# Altium schematic sheet DIO.SCHDOC
size B
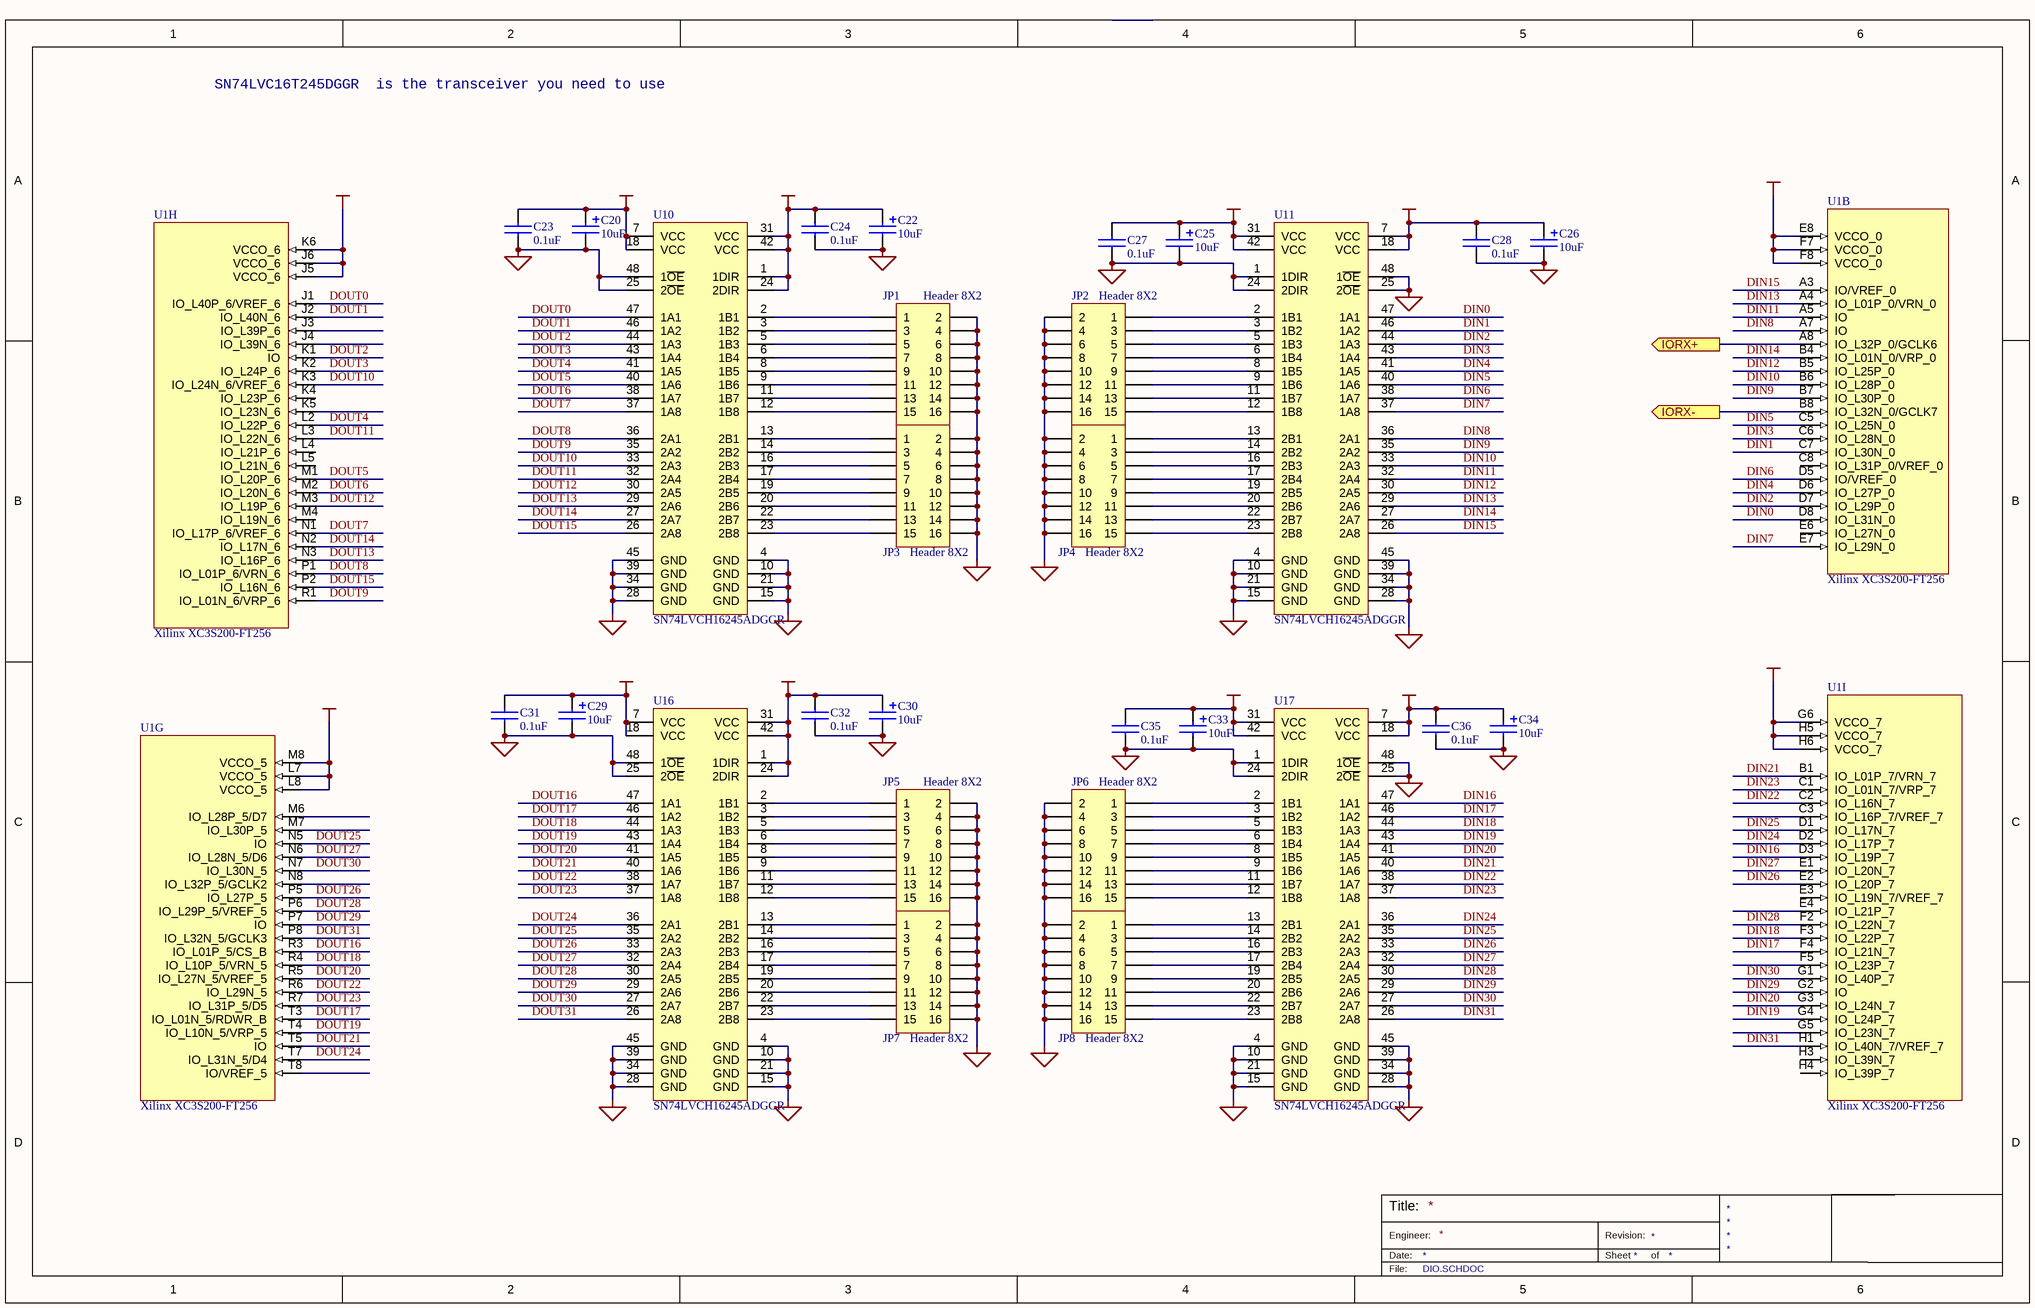
[diagram p0: DIO.SCHDOC]

## Parts
C20  value 10uF  [3216]  (hidden comment: POLCAP)
C22  value 10uF  [3216]  (hidden comment: POLCAP)
C23  value 0.1uF  [0603]  (hidden comment: CAPACITOR)
C24  value 0.1uF  [0603]  (hidden comment: CAPACITOR)
C25  value 10uF  [3216]  (hidden comment: POLCAP)
C26  value 10uF  [3216]  (hidden comment: POLCAP)
C27  value 0.1uF  [0603]  (hidden comment: CAPACITOR)
C28  value 0.1uF  [0603]  (hidden comment: CAPACITOR)
C29  value 10uF  [3216]  (hidden comment: POLCAP)
C30  value 10uF  [3216]  (hidden comment: POLCAP)
C31  value 0.1uF  [0603]  (hidden comment: CAPACITOR)
C32  value 0.1uF  [0603]  (hidden comment: CAPACITOR)
C33  value 10uF  [3216]  (hidden comment: POLCAP)
C34  value 10uF  [3216]  (hidden comment: POLCAP)
C35  value 0.1uF  [0603]  (hidden comment: CAPACITOR)
C36  value 0.1uF  [0603]  (hidden comment: CAPACITOR)
JP1  Header 8X2  [HDR2X8]
JP2  Header 8X2  [HDR2X8]
JP3  Header 8X2  [HDR2X8]
JP4  Header 8X2  [HDR2X8]
JP5  Header 8X2  [HDR2X8]
JP6  Header 8X2  [HDR2X8]
JP7  Header 8X2  [HDR2X8]
JP8  Header 8X2  [HDR2X8]
U1  Xilinx XC3S200-FT256  [Xilinx FT256 BGA]  (parts B,G,H,I of 9)
U10  SN74LVCH16245ADGGR  [TSSO12x8-G48/X.3]
U11  SN74LVCH16245ADGGR  [TSSO12x8-G48/X.3]
U16  SN74LVCH16245ADGGR  [TSSO12x8-G48/X.3]
U17  SN74LVCH16245ADGGR  [TSSO12x8-G48/X.3]

## Ports
IORX+ (out), IORX- (out)

## Nets
+2.5VCC: C22.1 C24.1 C25.1 C27.1 C30.1 C32.1 C33.1 C35.1 U1.E8(VCCO_0) U1.F7(VCCO_0) U1.F8(VCCO_0) U1.G6(VCCO_7) U1.H5(VCCO_7) U1.H6(VCCO_7) U1.J5(VCCO_6) U1.J6(VCCO_6) U1.K6(VCCO_6) U1.L7(VCCO_5) U1.L8(VCCO_5) U1.M8(VCCO_5) U10.1(1DIR) U10.24(2DIR) U10.31(VCC) U10.42(VCC) U11.31(VCC) U11.42(VCC) U16.1(1DIR) U16.24(2DIR) U16.31(VCC) U16.42(VCC) U17.31(VCC) U17.42(VCC)
+5VCC: C20.1 C23.1 C26.1 C28.1 C29.1 C31.1 C34.1 C36.1 U10.7(VCC) U10.18(VCC) U11.7(VCC) U11.18(VCC) U16.7(VCC) U16.18(VCC) U17.7(VCC) U17.18(VCC)
GND: C20.2 C22.2 C23.2 C24.2 C25.2 C26.2 C27.2 C28.2 C29.2 C30.2 C31.2 C32.2 C33.2 C34.2 C35.2 C36.2 JP1.2 JP1.4 JP1.6 JP1.8 JP1.10 JP1.12 JP1.14 JP1.16 JP2.2 JP2.4 JP2.6 JP2.8 JP2.10 JP2.12 JP2.14 JP2.16 JP3.2 JP3.4 JP3.6 JP3.8 JP3.10 JP3.12 JP3.14 JP3.16 JP4.2 JP4.4 JP4.6 JP4.8 JP4.10 JP4.12 JP4.14 JP4.16 JP5.2 JP5.4 JP5.6 JP5.8 JP5.10 JP5.12 JP5.14 JP5.16 JP6.2 JP6.4 JP6.6 JP6.8 JP6.10 JP6.12 JP6.14 JP6.16 JP7.2 JP7.4 JP7.6 JP7.8 JP7.10 JP7.12 JP7.14 JP7.16 JP8.2 JP8.4 JP8.6 JP8.8 JP8.10 JP8.12 JP8.14 JP8.16 U10.4(GND) U10.10(GND) U10.15(GND) U10.21(GND) U10.25(2~{OE}) U10.28(GND) U10.34(GND) U10.39(GND) U10.45(GND) U10.48(1~{OE}) U11.1(1DIR) U11.4(GND) U11.10(GND) U11.15(GND) U11.21(GND) U11.24(2DIR) U11.25(2~{OE}) U11.28(GND) U11.34(GND) U11.39(GND) U11.45(GND) U11.48(1~{OE}) U16.4(GND) U16.10(GND) U16.15(GND) U16.21(GND) U16.25(2~{OE}) U16.28(GND) U16.34(GND) U16.39(GND) U16.45(GND) U16.48(1~{OE}) U17.1(1DIR) U17.4(GND) U17.10(GND) U17.15(GND) U17.21(GND) U17.24(2DIR) U17.25(2~{OE}) U17.28(GND) U17.34(GND) U17.39(GND) U17.45(GND) U17.48(1~{OE})
DIN0: U1.D8(IO_L31N_0) U11.47(1A1)
DIN1: U1.C7(IO_L30N_0) U11.46(1A2)
DIN2: U1.D7(IO_L29P_0) U11.44(1A3)
DIN3: U1.C6(IO_L28N_0) U11.43(1A4)
DIN4: U1.D6(IO_L27P_0) U11.41(1A5)
DIN5: U1.C5(IO_L25N_0) U11.40(1A6)
DIN6: U1.D5(IO/VREF_0) U11.38(1A7)
DIN7: U1.E7(IO_L29N_0) U11.37(1A8)
DIN8: U1.A7(IO) U11.36(2A1)
DIN9: U1.B7(IO_L30P_0) U11.35(2A2)
DIN10: U1.B6(IO_L28P_0) U11.33(2A3)
DIN11: U1.A5(IO) U11.32(2A4)
DIN12: U1.B5(IO_L25P_0) U11.30(2A5)
DIN13: U1.A4(IO_L01P_0/VRN_0) U11.29(2A6)
DIN14: U1.B4(IO_L01N_0/VRP_0) U11.27(2A7)
DIN15: U1.A3(IO/VREF_0) U11.26(2A8)
DIN16: U1.D3(IO_L19P_7) U17.47(1A1)
DIN17: U1.F4(IO_L21N_7) U17.46(1A2)
DIN18: U1.F3(IO_L22P_7) U17.44(1A3)
DIN19: U1.G4(IO_L24P_7) U17.43(1A4)
DIN20: U1.G3(IO_L24N_7) U17.41(1A5)
DIN21: U1.B1(IO_L01P_7/VRN_7) U17.40(1A6)
DIN22: U1.C2(IO_L16N_7) U17.38(1A7)
DIN23: U1.C1(IO_L01N_7/VRP_7) U17.37(1A8)
DIN24: U1.D2(IO_L17P_7) U17.36(2A1)
DIN25: U1.D1(IO_L17N_7) U17.35(2A2)
DIN26: U1.E2(IO_L20P_7) U17.33(2A3)
DIN27: U1.E1(IO_L20N_7) U17.32(2A4)
DIN28: U1.F2(IO_L22N_7) U17.30(2A5)
DIN29: U1.G2(IO) U17.29(2A6)
DIN30: U1.G1(IO_L40P_7) U17.27(2A7)
DIN31: U1.H1(IO_L40N_7/VREF_7) U17.26(2A8)
DOUT0: U1.J1(IO_L40P_6/VREF_6) U10.47(1A1)
DOUT1: U1.J2(IO_L40N_6) U10.46(1A2)
DOUT2: U1.K1(IO) U10.44(1A3)
DOUT3: U1.K2(IO_L24P_6) U10.43(1A4)
DOUT4: U1.L2(IO_L22P_6) U10.41(1A5)
DOUT5: U1.M1(IO_L20P_6) U10.40(1A6)
DOUT6: U1.M2(IO_L20N_6) U10.38(1A7)
DOUT7: U1.N1(IO_L17P_6/VREF_6) U10.37(1A8)
DOUT8: U1.P1(IO_L01P_6/VRN_6) U10.36(2A1)
DOUT9: U1.R1(IO_L01N_6/VRP_6) U10.35(2A2)
DOUT10: U1.K3(IO_L24N_6/VREF_6) U10.33(2A3)
DOUT11: U1.L3(IO_L22N_6) U10.32(2A4)
DOUT12: U1.M3(IO_L19P_6) U10.30(2A5)
DOUT13: U1.N3(IO_L16P_6) U10.29(2A6)
DOUT14: U1.N2(IO_L17N_6) U10.27(2A7)
DOUT15: U1.P2(IO_L16N_6) U10.26(2A8)
DOUT16: U1.R3(IO_L01P_5/CS_B) U16.47(1A1)
DOUT17: U1.T3(IO_L01N_5/RDWR_B) U16.46(1A2)
DOUT18: U1.R4(IO_L10P_5/VRN_5) U16.44(1A3)
DOUT19: U1.T4(IO_L10N_5/VRP_5) U16.43(1A4)
DOUT20: U1.R5(IO_L27N_5/VREF_5) U16.41(1A5)
DOUT21: U1.T5(IO) U16.40(1A6)
DOUT22: U1.R6(IO_L29N_5) U16.38(1A7)
DOUT23: U1.R7(IO_L31P_5/D5) U16.37(1A8)
DOUT24: U1.T7(IO_L31N_5/D4) U16.36(2A1)
DOUT25: U1.N5(IO) U16.35(2A2)
DOUT26: U1.P5(IO_L27P_5) U16.33(2A3)
DOUT27: U1.N6(IO_L28N_5/D6) U16.32(2A4)
DOUT28: U1.P6(IO_L29P_5/VREF_5) U16.30(2A5)
DOUT29: U1.P7(IO) U16.29(2A6)
DOUT30: U1.N7(IO_L30N_5) U16.27(2A7)
DOUT31: U1.P8(IO_L32N_5/GCLK3) U16.26(2A8)
IORX+: U1.A8(IO_L32P_0/GCLK6) ; port IORX+
IORX-: U1.B8(IO_L32N_0/GCLK7) ; port IORX-
NetJP1_1: JP1.1 U10.2(1B1)
NetJP1_3: JP1.3 U10.3(1B2)
NetJP1_5: JP1.5 U10.5(1B3)
NetJP1_7: JP1.7 U10.6(1B4)
NetJP1_9: JP1.9 U10.8(1B5)
NetJP1_11: JP1.11 U10.9(1B6)
NetJP1_13: JP1.13 U10.11(1B7)
NetJP1_15: JP1.15 U10.12(1B8)
NetJP2_1: JP2.1 U11.2(1B1)
NetJP2_3: JP2.3 U11.3(1B2)
NetJP2_5: JP2.5 U11.5(1B3)
NetJP2_7: JP2.7 U11.6(1B4)
NetJP2_9: JP2.9 U11.8(1B5)
NetJP2_11: JP2.11 U11.9(1B6)
NetJP2_13: JP2.13 U11.11(1B7)
NetJP2_15: JP2.15 U11.12(1B8)
NetJP3_1: JP3.1 U10.13(2B1)
NetJP3_3: JP3.3 U10.14(2B2)
NetJP3_5: JP3.5 U10.16(2B3)
NetJP3_7: JP3.7 U10.17(2B4)
NetJP3_9: JP3.9 U10.19(2B5)
NetJP3_11: JP3.11 U10.20(2B6)
NetJP3_13: JP3.13 U10.22(2B7)
NetJP3_15: JP3.15 U10.23(2B8)
NetJP4_1: JP4.1 U11.13(2B1)
NetJP4_3: JP4.3 U11.14(2B2)
NetJP4_5: JP4.5 U11.16(2B3)
NetJP4_7: JP4.7 U11.17(2B4)
NetJP4_9: JP4.9 U11.19(2B5)
NetJP4_11: JP4.11 U11.20(2B6)
NetJP4_13: JP4.13 U11.22(2B7)
NetJP4_15: JP4.15 U11.23(2B8)
NetJP5_1: JP5.1 U16.2(1B1)
NetJP5_3: JP5.3 U16.3(1B2)
NetJP5_5: JP5.5 U16.5(1B3)
NetJP5_7: JP5.7 U16.6(1B4)
NetJP5_9: JP5.9 U16.8(1B5)
NetJP5_11: JP5.11 U16.9(1B6)
NetJP5_13: JP5.13 U16.11(1B7)
NetJP5_15: JP5.15 U16.12(1B8)
NetJP6_1: JP6.1 U17.2(1B1)
NetJP6_3: JP6.3 U17.3(1B2)
NetJP6_5: JP6.5 U17.5(1B3)
NetJP6_7: JP6.7 U17.6(1B4)
NetJP6_9: JP6.9 U17.8(1B5)
NetJP6_11: JP6.11 U17.9(1B6)
NetJP6_13: JP6.13 U17.11(1B7)
NetJP6_15: JP6.15 U17.12(1B8)
NetJP7_1: JP7.1 U16.13(2B1)
NetJP7_3: JP7.3 U16.14(2B2)
NetJP7_5: JP7.5 U16.16(2B3)
NetJP7_7: JP7.7 U16.17(2B4)
NetJP7_9: JP7.9 U16.19(2B5)
NetJP7_11: JP7.11 U16.20(2B6)
NetJP7_13: JP7.13 U16.22(2B7)
NetJP7_15: JP7.15 U16.23(2B8)
NetJP8_1: JP8.1 U17.13(2B1)
NetJP8_3: JP8.3 U17.14(2B2)
NetJP8_5: JP8.5 U17.16(2B3)
NetJP8_7: JP8.7 U17.17(2B4)
NetJP8_9: JP8.9 U17.19(2B5)
NetJP8_11: JP8.11 U17.20(2B6)
NetJP8_13: JP8.13 U17.22(2B7)
NetJP8_15: JP8.15 U17.23(2B8)

Not connected (* = marked no-connect by the designer): U1 C3(IO_L16P_7/VREF_7) C8(IO_L31P_0/VREF_0) E3(IO_L19N_7/VREF_7) E4(IO_L21P_7) E6(IO_L27N_0) F5(IO_L23P_7) G5(IO_L23N_7) H3(IO_L39N_7) H4(IO_L39P_7) J3(IO_L39P_6) J4(IO_L39N_6) K4(IO_L23P_6) K5(IO_L23N_6) L4(IO_L21P_6) L5(IO_L21N_6) M4(IO_L19N_6) M6(IO_L28P_5/D7) M7(IO_L30P_5) N8(IO_L32P_5/GCLK2) T8(IO/VREF_5)

## Notes on the sheet
- SN74LVC16T245DGGR  is the transceiver you need to use
- Title:
- Engineer:
- Date:
- Revision:
- Sheet
- of
- File:

## Library data of the parts
C20 C22 C25 C26 C29 C30 C33 C34 = POLCAP: Standard Capacitor; Type: Tantalum
C23 C24 C27 C28 C31 C32 C35 C36 = CAPACITOR: Standard Capacitor; Type: X7R
JP1-JP8 = Header 8X2: Header, 8-Pin, Dual row; Manufacturer: Generic Components; Class I: Connector; Revision: July-2002: Re-released for DXP Platform.; Publisher: Altium Limited
U1 = XC3S200-FT256: Xilinx Spartan-3 FPGA
U10 U11 U16 U17 = SN74LVCH16245ADGGR: 16-bit bus transceiver with 3-state outputs